# EAGLE schematic PoElli-RasPi-mechanics-offset-RJ45 (EAGLE 6.5.2)
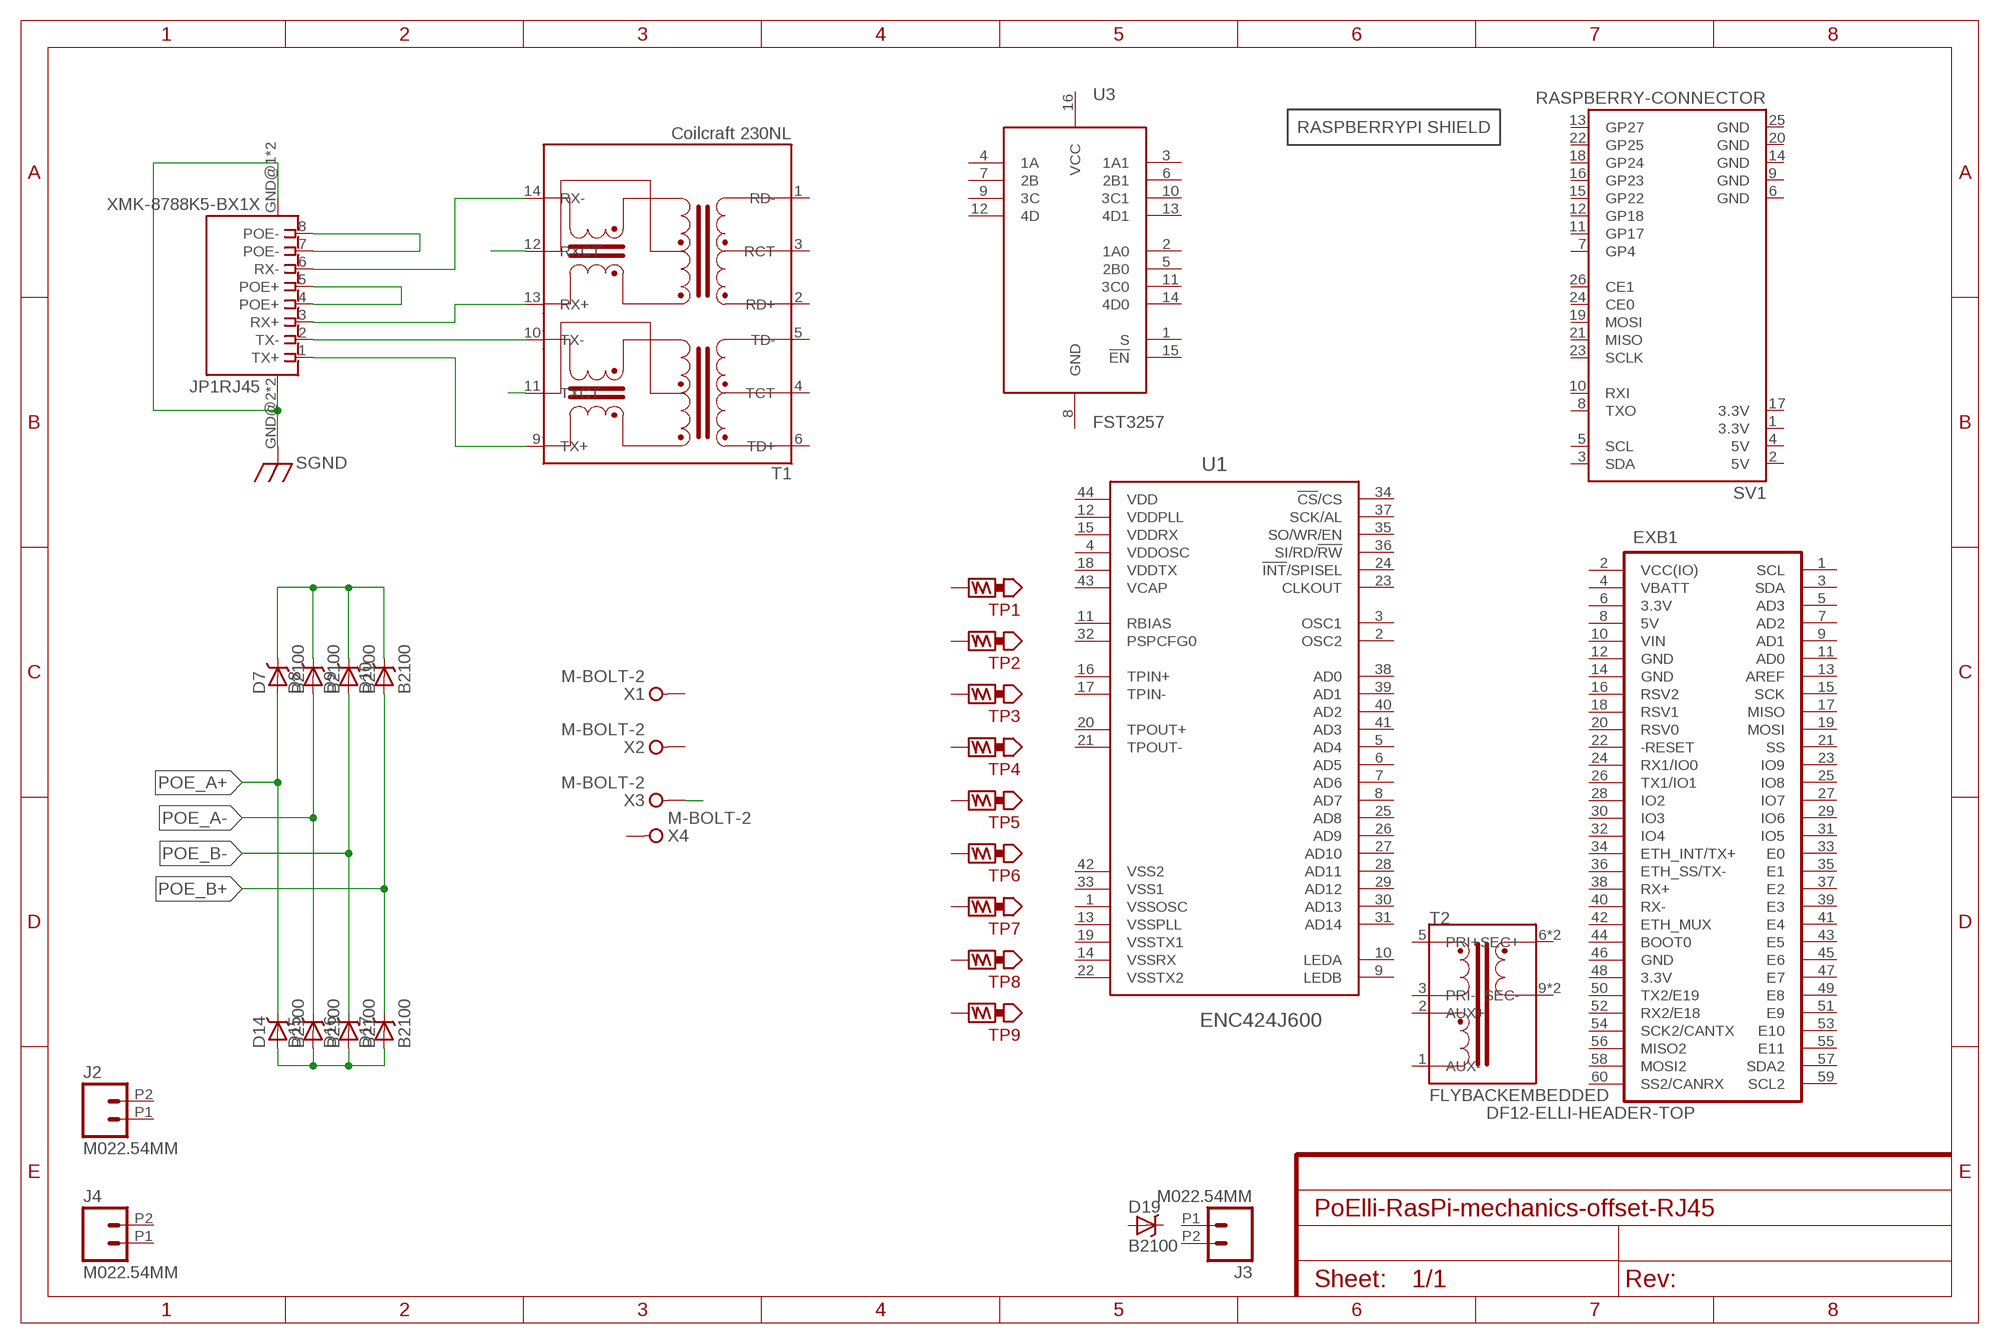
[diagram p0: schematic, sheet 1]

## Parts
D7  B2100  DIODE-SCHOTTKYB2100  [DIODE-B2100]
D8  B2100  DIODE-SCHOTTKYB2100  [DIODE-B2100]
D9  B2100  DIODE-SCHOTTKYB2100  [DIODE-B2100]
D10  B2100  DIODE-SCHOTTKYB2100  [DIODE-B2100]
D14  B2100  DIODE-SCHOTTKYB2100  [DIODE-B2100]
D15  B2100  DIODE-SCHOTTKYB2100  [DIODE-B2100]
D16  B2100  DIODE-SCHOTTKYB2100  [DIODE-B2100]
D17  B2100  DIODE-SCHOTTKYB2100  [DIODE-B2100]
D19  B2100  DIODE-SCHOTTKYB2100  [DIODE-B2100]
EXB1  DF12-ELLI-HEADER-TOP  [DF12(4.0)-60DP-0.5V]
J2  M022.54MM  M022.54MM_SCREWTERM  [1X02_2.54_SCREWTERM]
J3  M022.54MM  M022.54MM_SCREWTERM  [1X02_2.54_SCREWTERM]
J4  M022.54MM  M022.54MM_SCREWTERM  [1X02_2.54_SCREWTERM]
JP1  XMK-8788K5-BX1X  POE-TP-SHIELDED-LEDSTE1888250  [TE1888250]
OUTLINE1  RASPBERRY-OUTLINE  [RASPBERRYPI-SHIELD-OUTLINE]
SV1  RASPBERRY-CONNECTOR  [RASPBERRYPI-SHIELD-CONNECTOR]
T1  Coilcraft 230NL  POE-ISOLATION-230NL  [COILCRAFT-ETH1-230L]
T2  FLYBACKEMBEDDED  [WE_EP13_SMD_10PIN_EMBEDDED]
TP1  TEST_POINT-5000  [TP_5021]
TP2  TEST_POINT-5021  [TP_5000]
TP3  TEST_POINT-5021  [TP_5000]
TP4  TEST_POINT-5021  [TP_5000]
TP5  TEST_POINT-5000  [TP_5021]
TP6  TEST_POINT-5000  [TP_5021]
TP7  TEST_POINT-5000  [TP_5021]
TP8  TEST_POINT-5000  [TP_5021]
TP9  TEST_POINT-5000  [TP_5021]
U1  ENC424J600  [TQFP44-0.8MM]
U3  FST3257  [SOIC-16-NARROW]
X1  M-BOLT-2  [M2-1]
X2  M-BOLT-2  [M2-1]
X3  M-BOLT-2  [M2-1]
X4  M-BOLT-2  [M2-1]

## Nets
N$1: JP1.2(RJ45:TX-) T1.10(TX-)
N$2: JP1.1(RJ45:TX+) T1.9(TX+)
N$3: JP1.3(RJ45:RX+) T1.13(RX+)
N$4: JP1.6(RJ45:RX-) T1.14(RX-)
N$6: D7.C D8.C D9.C D10.C
N$8: D14.A D15.A D16.A D17.A
N$10: JP1.7(RJ45:POE-) JP1.8(RJ45:POE-)
N$13: T1.11(TXCT)
N$21: X3.1(KL1)
POE_A+: D7.A D14.C
POE_A-: D8.A D15.C T1.12(RXCT)
POE_B+: D10.A D17.C JP1.4(RJ45:POE+) JP1.5(RJ45:POE+)
POE_B-: D9.A D16.C
RTN: JP1.GND@1(RJ45:GND) JP1.GND@2(RJ45:GND) JP1.GND@3(RJ45:GND) JP1.GND@4(RJ45:GND) ; supply symbol labelled SGND
Unconnected: D19.A D19.C EXB1.1(SCL) EXB1.3(SDA) EXB1.5(AD3) EXB1.7(AD2) EXB1.9(AD1) EXB1.11(AD0) EXB1.13(AREF) EXB1.15(SCK) EXB1.16(RSV2) EXB1.17(MISO) EXB1.18(RSV1) EXB1.19(MOSI) EXB1.20(RSV0) EXB1.21(SS) EXB1.22(-RESET) EXB1.23(IO9) EXB1.24(RX1/IO0) EXB1.25(IO8) EXB1.26(TX1/IO1) EXB1.27(IO7) EXB1.28(IO2) EXB1.29(IO6) EXB1.30(IO3) EXB1.31(IO5) EXB1.32(IO4) EXB1.33(E0) EXB1.34(ETH_INT/TX+) EXB1.35(E1) EXB1.36(ETH_SS/TX-) EXB1.37(E2) EXB1.38(RX+) EXB1.39(E3) EXB1.40(RX-) EXB1.41(E4) EXB1.42(ETH_MUX) EXB1.43(E5) EXB1.44(BOOT0) EXB1.45(E6) EXB1.46(GND) EXB1.47(E7) EXB1.48(3.3V) EXB1.49(E8) EXB1.50(TX2/E19) EXB1.51(E9) EXB1.52(RX2/E18) EXB1.53(E10) EXB1.54(SCK2/CANTX) EXB1.55(E11) EXB1.56(MISO2) EXB1.57(SDA2) EXB1.58(MOSI2) EXB1.59(SCL2) EXB1.60(SS2/CANRX) J2.P1 J2.P2 J3.P1 J3.P2 J4.P1 J4.P2 JP1.9(LED1:C) JP1.10(LED1:A) JP1.11(LED2:A) JP1.12(LED2:C) SV1.3(SDA) SV1.5(SCL) SV1.7(GP4) SV1.8(TXO) SV1.10(RXI) SV1.11(GP17) SV1.12(GP18) SV1.13(GP27) SV1.15(GP22) SV1.16(GP23) SV1.18(GP24) SV1.19(MOSI) SV1.21(MISO) SV1.22(GP25) SV1.23(SCLK) SV1.24(CE0) SV1.26(CE1) T1.1(RD-) T1.2(RD+) T1.3(RCT) T1.4(TCT) T1.5(TD-) T1.6(TD+) T2.1(AUX-) T2.2(AUX+) T2.3(PRI-) T2.5(PRI+) T2.6(SEC+) T2.7(SEC+) T2.9(SEC-) T2.10(SEC-) TP1.P$1 TP2.P$1 TP3.P$1 TP4.P$1 TP5.P$1 TP6.P$1 TP7.P$1 TP8.P$1 TP9.P$1 U1.2(OSC2) U1.3(OSC1) U1.5(AD4) U1.6(AD5) U1.7(AD6) U1.8(AD7) U1.9(LEDB) U1.10(LEDA) U1.11(RBIAS) U1.16(TPIN+) U1.17(TPIN-) U1.20(TPOUT+) U1.21(TPOUT-) U1.23(CLKOUT) U1.24(!INT!/SPISEL) U1.25(AD8) U1.26(AD9) U1.27(AD10) U1.28(AD11) U1.29(AD12) U1.30(AD13) U1.31(AD14) U1.32(PSPCFG0) U1.34(!CS!/CS) U1.35(SO/WR/EN) U1.36(SI/RD/!RW) U1.37(SCK/AL) U1.38(AD0) U1.39(AD1) U1.40(AD2) U1.41(AD3) U3.1(S) U3.2(1A0) U3.3(1A1) U3.4(1A) U3.5(2B0) U3.6(2B1) U3.7(2B) U3.9(3C) U3.10(3C1) U3.11(3C0) U3.12(4D) U3.13(4D1) U3.14(4D0) U3.15(!EN) X1.1(KL1) X2.1(KL1) X4.1(KL1)

## Power pins joined to a net without a drawn wire
3.3V: EXB1.6(3.3V) SV1.1(3.3V) SV1.17(3.3V)
5V: EXB1.8(5V) SV1.2(5V) SV1.4(5V)
GND: EXB1.12(GND) EXB1.14(GND) SV1.6(GND) SV1.9(GND) SV1.14(GND) SV1.20(GND) SV1.25(GND) U3.8(GND)
VBATT: EXB1.4(VBATT)
VCAP: U1.43(VCAP)
VCC: U3.16(VCC)
VCC(IO): EXB1.2(VCC(IO))
VDD: U1.44(VDD)
VDDOSC: U1.4(VDDOSC)
VDDPLL: U1.12(VDDPLL)
VDDRX: U1.15(VDDRX)
VDDTX: U1.18(VDDTX)
VIN: EXB1.10(VIN)
VSS1: U1.33(VSS1)
VSS2: U1.42(VSS2)
VSSOSC: U1.1(VSSOSC)
VSSPLL: U1.13(VSSPLL)
VSSRX: U1.14(VSSRX)
VSSTX1: U1.19(VSSTX1)
VSSTX2: U1.22(VSSTX2)

## Library data of the parts
D7-D10 D14-D17 D19 = ELL-i-DIscreteSemi:DIODE-SCHOTTKY: Schottky Diodes A Schottky diode has a low forward voltage drop and a very fast switching action. A normal silicon diode has a voltage drop between 0.6–0.7 volts, while a Schottky diode voltage drop is between approximately 0.15–0.45 volts. This lower voltage drop can provide higher switching speed and better system efficiency. Wikipedia article on Schottky diodes <https://en.wikipedia.org/wiki/Schottky_diode>
EXB1 = ELL-i-Connectors:DF12-ELLI-*
J2-J4 = SparkFun-Connectors:M02: Standard 2-pin 0.1" header. Use with - straight break away headers ( PRT-00116) - right angle break away headers (PRT-00553) - swiss pins (PRT-00743) - machine pins (PRT-00117) - female headers (PRT-00115) Molex polarized connector foot print use with: PRT-08233 with associated crimp pins and housings. 2.54_SCREWTERM for use with PRT-10571. 3.5mm Screw Terminal footprints for PRT-08084 5mm Screw Terminal footprints for use with PRT-08433
JP1 = ELL-i-Connectors:POE-TP-SHIELDED-LEDS: Twisted pair Power-over-Ethernet MDI connector, with protective ground and LEDs 8-wire Ethernet jack, with a protective ground and status LEDs. See the POE-TP device for more information.
OUTLINE1 = ELL-i-Boards:RASPBERRY-OUTLINE
SV1 = ELL-i-Boards:RASPBERRY-CONNECTOR
T1 = ELL-i-Transformers:POE-ISOLATION: Power-over-Ethernet isolation transformers In twisted pair Ethernet networks, there is a 1500V isolation transformer between the network cable and the connected device. In Power-over-Ethernet devices, the transformer provides the extra function of allowing the DC power to be extracted from the cable-side center taps of the transformer. For high-power PoE, the transformer cable-side winding must be of thick enough wire (i.e. have low-enough resistance) to carry the DC current without warming up too much. Isolation transformers <https://en.wikipedia.org/wiki/Isolation_transformer> (general article) Power-over-Ethernet <https://en.wikipedia.org/wiki/Power_over_Ethernet> (general article)
T2 = ELL-i-Transformers:FLYBACK: Flyback SMPS transformer These types of transformers are often used in flyback and forward SMPS converters. The primary-side auxillary winding typically used to generate a 7-12 V auxillary voltage, which is used to generate the operating voltage (VCC) for the SMPS controller chip. The packages includes the ones used at various ELL-i boards.
TP1-TP9 = ELL-i-Passives:TEST_POINT: Used for easier attachment of measuring equipment. Has both test loops and bare copper area.
U1 = ELL-i-DigitalIC:ENC424J600: ENC424J600 The ENC424J600 and ENC624J600 are stand-alone, Fast Ethernet controllers with an industry standard Serial Peripheral Interface (SPI) or a flexible parallel interface. They are designed to serve as an Ethernet network interface for any microcontroller equipped with SPI or a standard parallel port Not reviewed. Datasheet <http://ww1.microchip.com/downloads/en/DeviceDoc/39935b.pdf>
U3 = ELL-i-DigitalIC:FST3257: Quad 2:1 Multiplexer / Demultiplexer Bus Switch
X1-X4 = ELL-i-Connectors:M-BOLT: Metric bolt connector